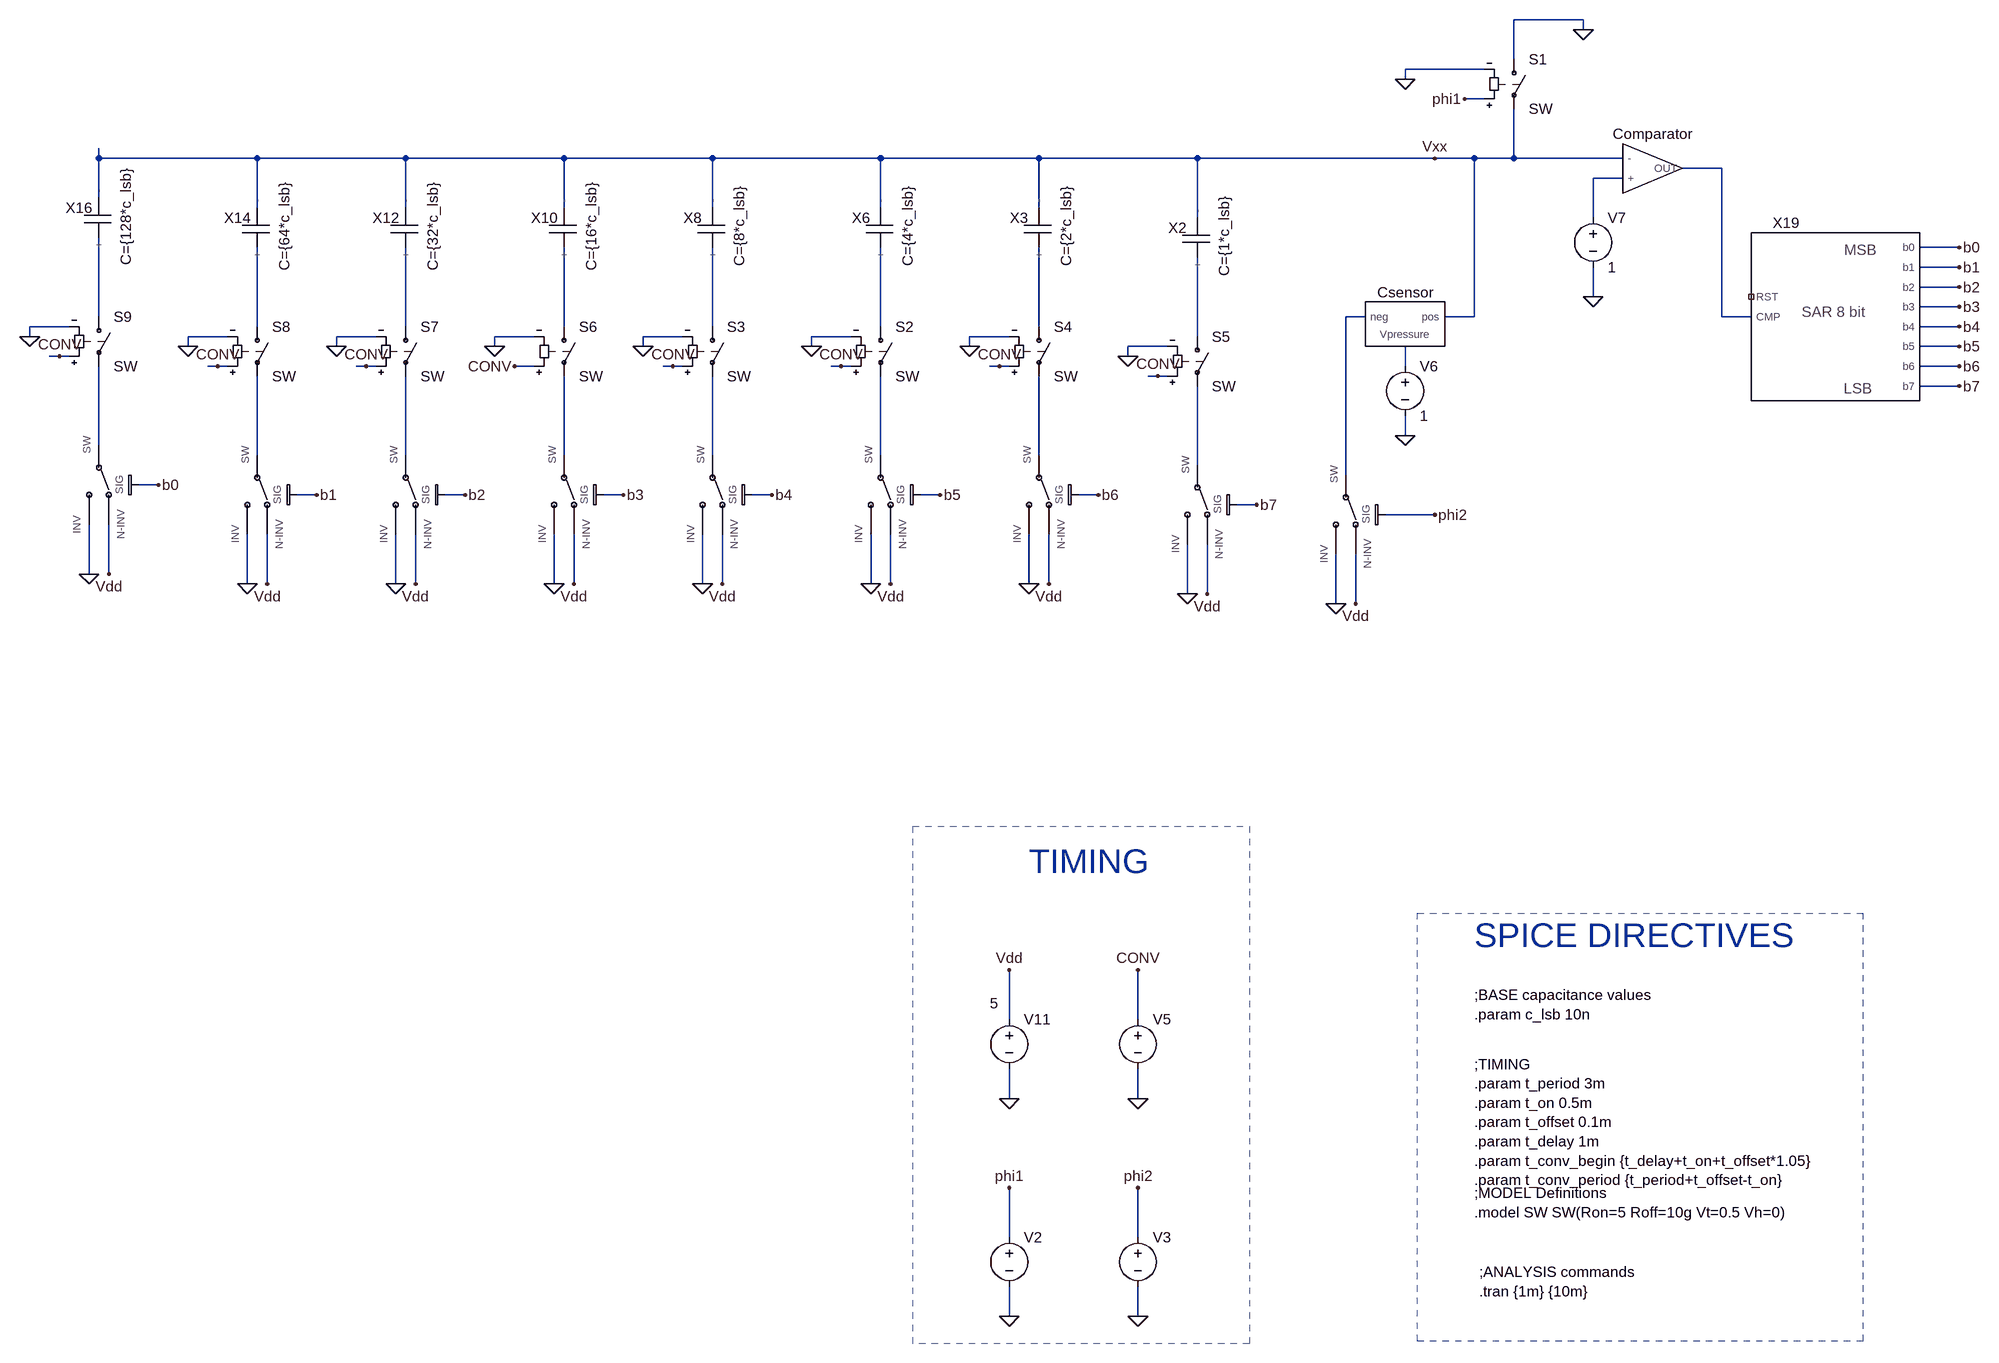
[diagram p0: schematic CIR_CDC.asc]
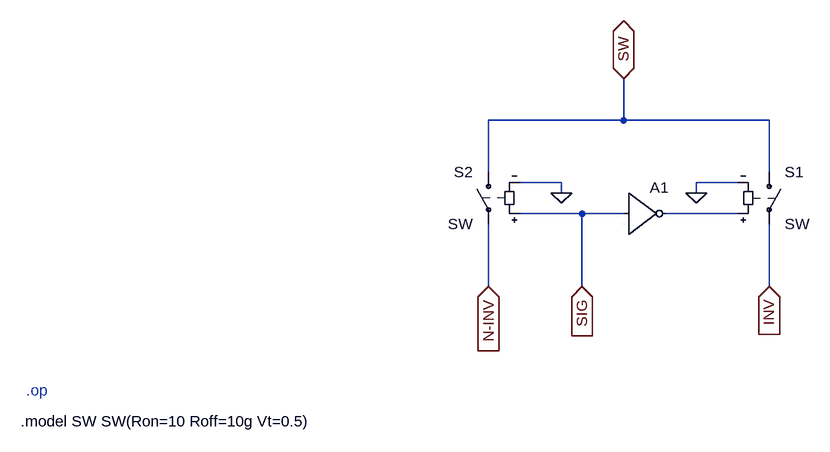
[diagram p1: sub-circuit com_spdt.asc]
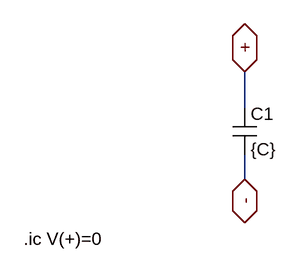
[diagram p2: sub-circuit com_cap.asc]
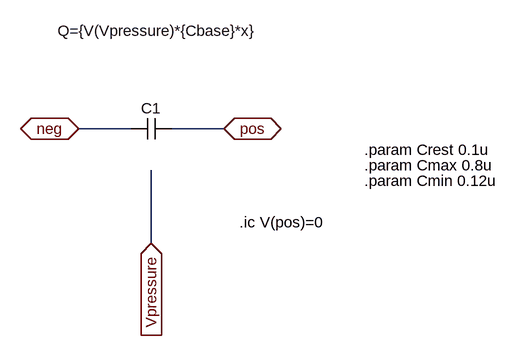
[diagram p3: sub-circuit sensor_cap.asc]
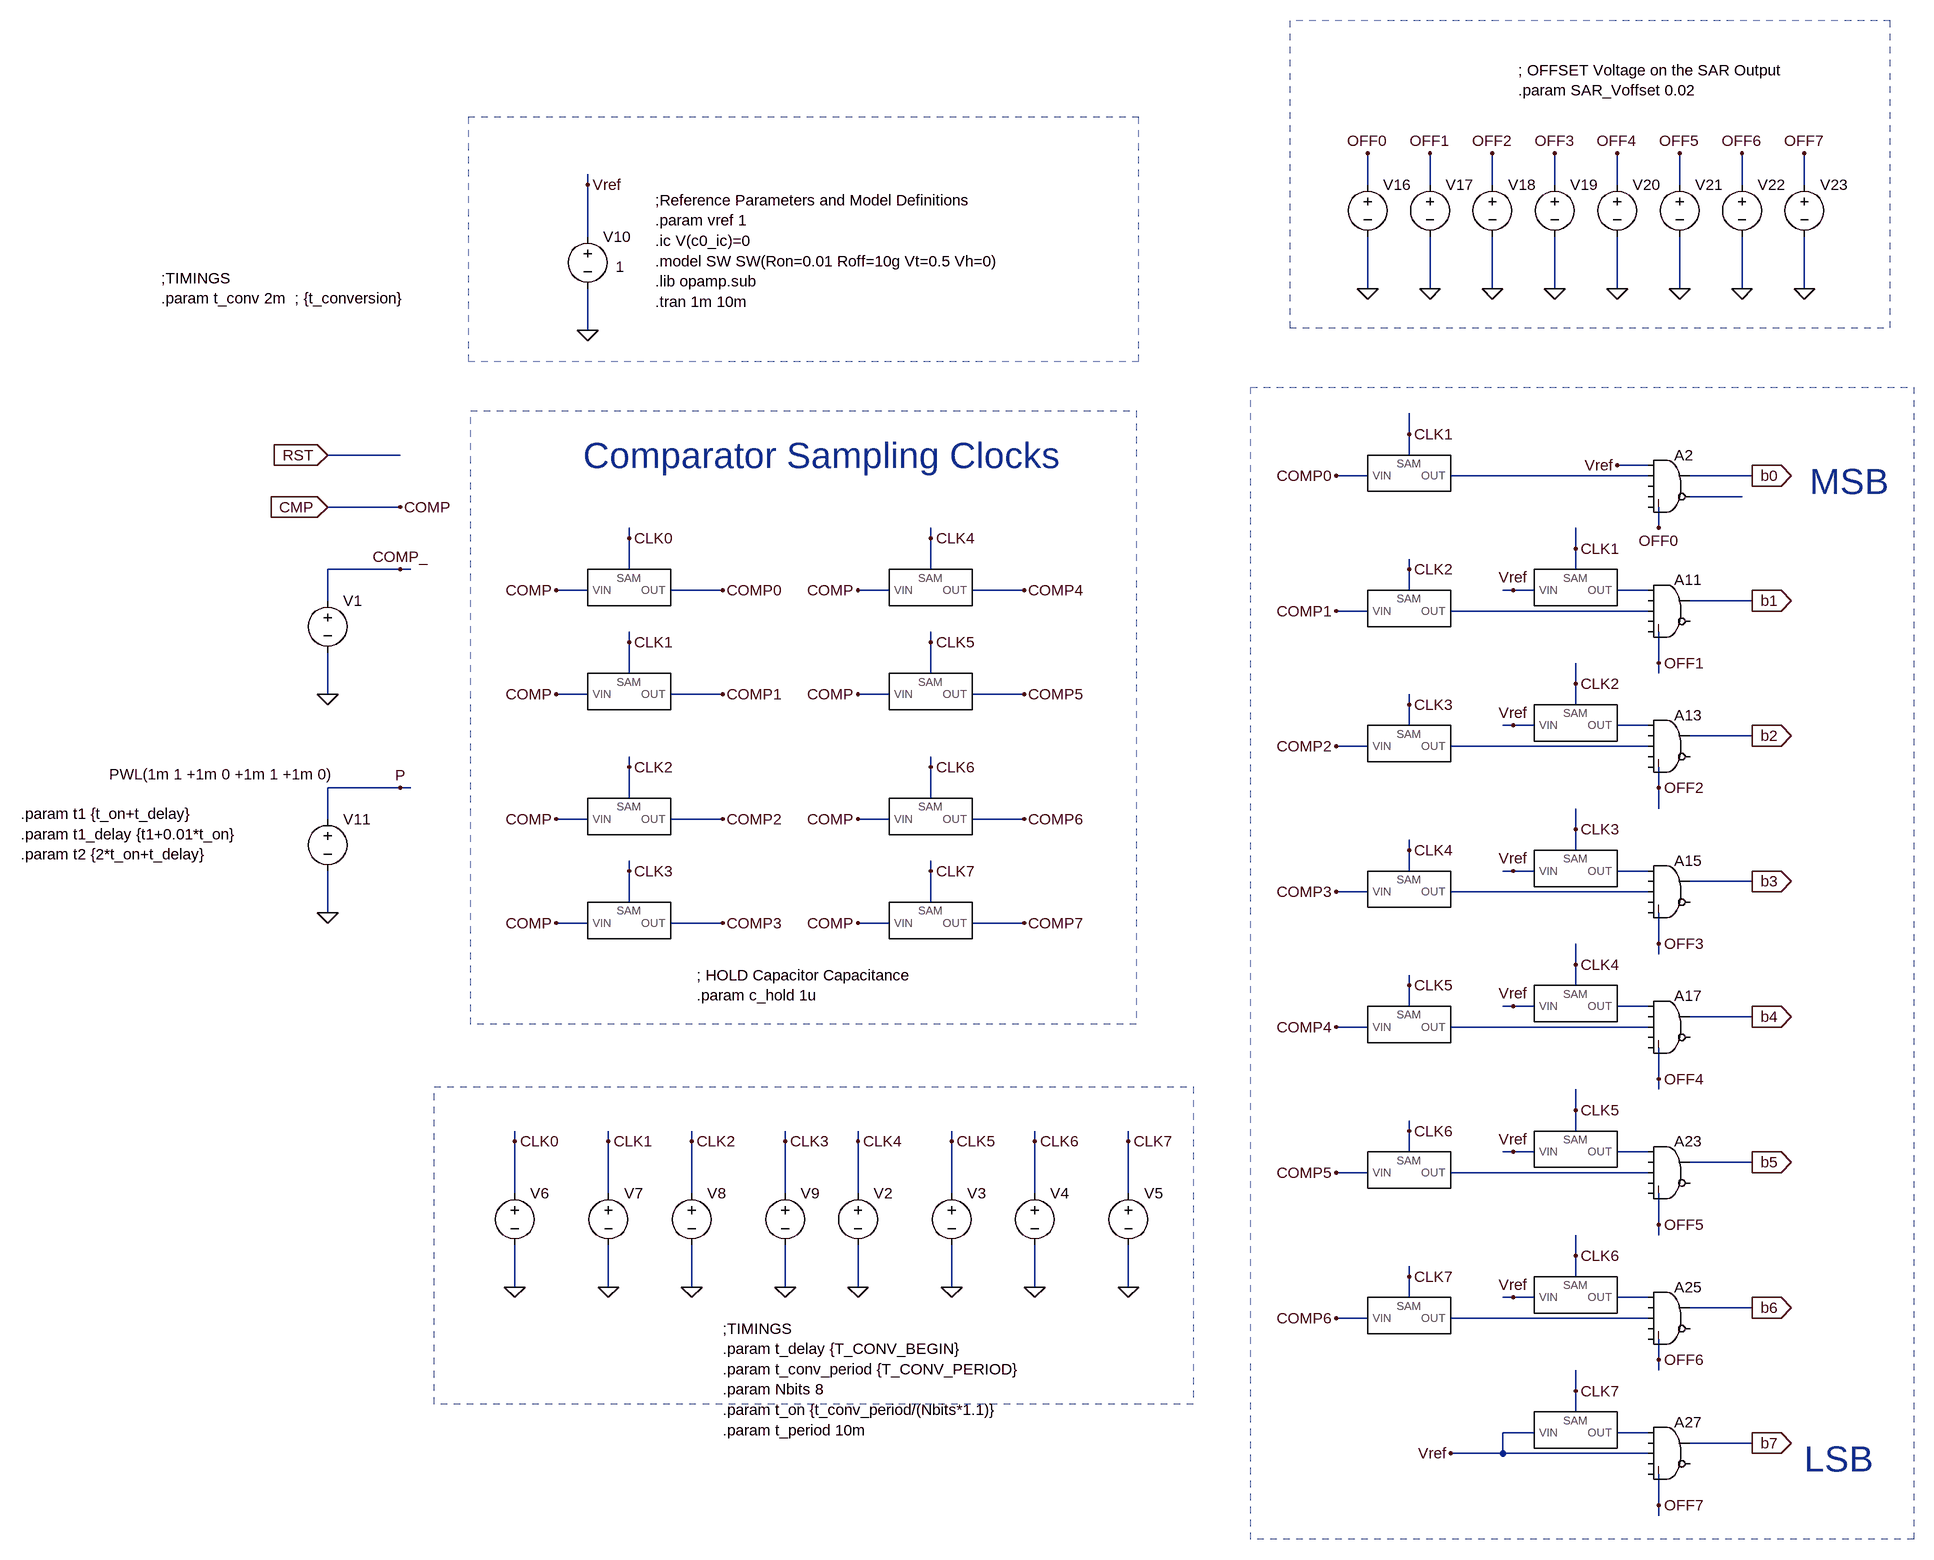
[diagram p4: sub-circuit com_sar.asc]
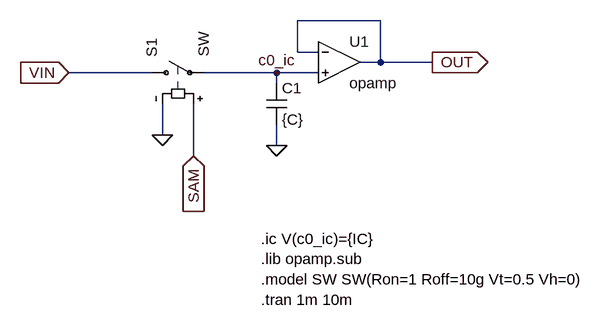
[diagram p5: sub-circuit com_sampleandhold.asc]
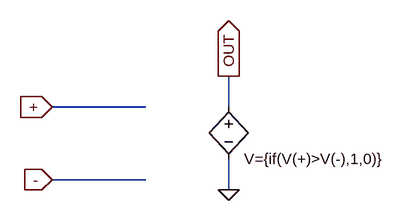
[diagram p6: sub-circuit com_comparator.asc]
CIR_CDC.asc, the LTspice schematic file:
Version 4
SHEET 1 3520 3184
WIRE 1216 144 1104 144
WIRE 1216 160 1216 144
WIRE 1104 208 1104 144
WIRE 1056 224 928 224
WIRE 928 240 928 224
WIRE 1056 272 1024 272
WIRE -1184 368 -1184 352
WIRE -928 368 -1184 368
WIRE -688 368 -928 368
WIRE -432 368 -688 368
WIRE -192 368 -432 368
WIRE 80 368 -192 368
WIRE 336 368 80 368
WIRE 592 368 336 368
WIRE 976 368 592 368
WIRE 1040 368 976 368
WIRE 1104 368 1104 288
WIRE 1104 368 1040 368
WIRE 1280 368 1104 368
WIRE 1440 384 1376 384
WIRE 1280 400 1232 400
WIRE -1184 432 -1184 368
WIRE -928 448 -928 368
WIRE -688 448 -688 368
WIRE -432 448 -432 368
WIRE -192 448 -192 368
WIRE 80 448 80 368
WIRE 336 448 336 368
WIRE 592 464 592 368
WIRE 1232 464 1232 400
WIRE 1824 512 1760 512
WIRE 1824 544 1760 544
WIRE 1824 576 1760 576
WIRE 1232 592 1232 544
WIRE 1824 608 1760 608
WIRE -1184 624 -1184 496
WIRE 864 624 832 624
WIRE 1040 624 1040 368
WIRE 1040 624 992 624
WIRE 1440 624 1440 384
WIRE 1488 624 1440 624
WIRE -1232 640 -1296 640
WIRE -928 640 -928 512
WIRE -688 640 -688 512
WIRE -432 640 -432 512
WIRE -192 640 -192 512
WIRE 80 640 80 512
WIRE 336 640 336 512
WIRE 1824 640 1760 640
WIRE -1296 656 -1296 640
WIRE -976 656 -1040 656
WIRE -736 656 -800 656
WIRE -480 656 -544 656
WIRE -240 656 -304 656
WIRE 32 656 -32 656
WIRE 288 656 224 656
WIRE 592 656 592 528
WIRE -1040 672 -1040 656
WIRE -800 672 -800 656
WIRE -544 672 -544 656
WIRE -304 672 -304 656
WIRE -32 672 -32 656
WIRE 224 672 224 656
WIRE 544 672 480 672
WIRE 1824 672 1760 672
WIRE -1248 688 -1264 688
WIRE -1232 688 -1248 688
WIRE 480 688 480 672
WIRE -992 704 -1008 704
WIRE -976 704 -992 704
WIRE -752 704 -768 704
WIRE -736 704 -752 704
WIRE -480 704 -512 704
WIRE -256 704 -272 704
WIRE -240 704 -256 704
WIRE 16 704 0 704
WIRE 32 704 16 704
WIRE 272 704 256 704
WIRE 288 704 272 704
WIRE 928 704 928 672
WIRE 1824 704 1760 704
WIRE 528 720 512 720
WIRE 544 720 528 720
WIRE 1824 736 1760 736
WIRE 928 816 928 784
WIRE -1184 832 -1184 704
WIRE -928 848 -928 720
WIRE -688 848 -688 720
WIRE -432 848 -432 720
WIRE -192 848 -192 720
WIRE 80 848 80 720
WIRE 336 848 336 720
WIRE 592 864 592 736
WIRE 832 880 832 624
WIRE -1088 896 -1120 896
WIRE -832 912 -864 912
WIRE -592 912 -624 912
WIRE -336 912 -368 912
WIRE -96 912 -128 912
WIRE 176 912 144 912
WIRE 432 912 400 912
WIRE 688 928 656 928
WIRE 976 944 896 944
WIRE -1200 1040 -1200 960
WIRE -1168 1040 -1168 960
WIRE -944 1056 -944 976
WIRE -912 1056 -912 976
WIRE -704 1056 -704 976
WIRE -672 1056 -672 976
WIRE -448 1056 -448 976
WIRE -416 1056 -416 976
WIRE -208 1056 -208 976
WIRE -176 1056 -176 976
WIRE 64 1056 64 976
WIRE 96 1056 96 976
WIRE 320 1056 320 976
WIRE 352 1056 352 976
WIRE 576 1072 576 992
WIRE 608 1072 608 992
WIRE 816 1088 816 1008
WIRE 848 1088 848 1008
WIRE 288 1760 288 1680
WIRE 496 1760 496 1680
WIRE 288 1888 288 1840
WIRE 496 1888 496 1840
WIRE 288 2112 288 2032
WIRE 496 2112 496 2032
WIRE 288 2240 288 2192
WIRE 496 2240 496 2192
FLAG 288 1888 0
FLAG 288 1680 Vdd
FLAG 1216 160 0
FLAG 288 2240 0
FLAG 288 2032 phi1
FLAG 496 2240 0
FLAG 496 2032 phi2
FLAG 1024 272 phi1
FLAG 928 240 0
FLAG 976 368 Vxx
FLAG 496 1888 0
FLAG 496 1680 CONV
FLAG 272 704 CONV
FLAG 224 672 0
FLAG 528 720 CONV
FLAG 480 688 0
FLAG 816 1088 0
FLAG 848 1088 Vdd
FLAG 976 944 phi2
FLAG 320 1056 0
FLAG 352 1056 Vdd
FLAG 576 1072 0
FLAG 608 1072 Vdd
FLAG 16 704 CONV
FLAG -32 672 0
FLAG 64 1056 0
FLAG 96 1056 Vdd
FLAG 176 912 b5
FLAG -256 704 CONV
FLAG -304 672 0
FLAG -208 1056 0
FLAG -176 1056 Vdd
FLAG -96 912 b4
FLAG -544 672 0
FLAG -448 1056 0
FLAG -416 1056 Vdd
FLAG -336 912 b3
FLAG -800 672 0
FLAG -704 1056 0
FLAG -672 1056 Vdd
FLAG -992 704 CONV
FLAG -1040 672 0
FLAG -944 1056 0
FLAG -912 1056 Vdd
FLAG -752 704 CONV
FLAG -512 704 CONV
FLAG -832 912 b1
FLAG -1248 688 CONV
FLAG -1296 656 0
FLAG -1200 1040 0
FLAG -1168 1040 Vdd
FLAG -1088 896 b0
FLAG -592 912 b2
FLAG 928 816 0
FLAG 1232 592 0
FLAG 1824 512 b0
FLAG 1824 544 b1
FLAG 1824 576 b2
FLAG 1824 608 b3
FLAG 1824 640 b4
FLAG 1824 672 b5
FLAG 1824 704 b6
FLAG 1824 736 b7
FLAG 432 912 b6
FLAG 688 928 b7
SYMBOL voltage 288 1744 R0
WINDOW 3 -31 -10 Left 2
WINDOW 0 24 16 Left 2
SYMATTR Value 5
SYMATTR InstName V11
SYMBOL voltage 496 2096 R0
WINDOW 3 -196 -32 Invisible 2
WINDOW 0 24 16 Left 2
SYMATTR Value PULSE(0 3 {t_delay} 1n 1n {t_on+t_offset} {t_period} 1)
SYMATTR InstName V3
SYMBOL voltage 288 2096 R0
WINDOW 3 -196 -32 Invisible 2
WINDOW 0 24 16 Left 2
SYMATTR Value PULSE(0 3 {t_delay} 1n 1n {t_on} {t_period} 1)
SYMATTR InstName V2
SYMBOL sw 1104 192 R0
SYMATTR InstName S1
SYMBOL voltage 496 1744 R0
WINDOW 3 -196 -32 Invisible 2
WINDOW 0 24 16 Left 2
SYMATTR Value PULSE(0 3 {t_conv_begin} 1n 1n {t_conv_period} {t_period} 1)
SYMATTR InstName V5
SYMBOL sw 336 624 R0
SYMATTR InstName S4
SYMBOL sw 592 640 R0
SYMATTR InstName S5
SYMBOL COM_SPDT 832 976 R270
WINDOW 0 48 -64 Invisible 2
SYMATTR InstName X1
SYMBOL COM_CAP 592 496 R180
WINDOW 0 32 16 Center 2
WINDOW 3 -28 0 VBottom 2
SYMATTR InstName X2
SYMATTR Value C={1*c_lsb}
SYMBOL COM_CAP 336 480 R180
WINDOW 0 32 16 Center 2
WINDOW 3 -28 0 VBottom 2
SYMATTR InstName X3
SYMATTR Value C={2*c_lsb}
SYMBOL COM_SPDT 336 944 R270
WINDOW 0 48 -64 Invisible 2
SYMATTR InstName X4
SYMBOL COM_SPDT 592 960 R270
WINDOW 0 48 -64 Invisible 2
SYMATTR InstName X5
SYMBOL sw 80 624 R0
SYMATTR InstName S2
SYMBOL COM_CAP 80 480 R180
WINDOW 0 32 16 Center 2
WINDOW 3 -28 0 VBottom 2
SYMATTR InstName X6
SYMATTR Value C={4*c_lsb}
SYMBOL COM_SPDT 80 944 R270
WINDOW 0 48 -64 Invisible 2
SYMATTR InstName X7
SYMBOL sw -192 624 R0
SYMATTR InstName S3
SYMBOL COM_CAP -192 480 R180
WINDOW 0 32 16 Center 2
WINDOW 3 -28 0 VBottom 2
SYMATTR InstName X8
SYMATTR Value C={8*c_lsb}
SYMBOL COM_SPDT -192 944 R270
WINDOW 0 48 -64 Invisible 2
SYMATTR InstName X9
SYMBOL sw -432 624 R0
SYMATTR InstName S6
SYMBOL COM_CAP -432 480 R180
WINDOW 0 32 16 Center 2
WINDOW 3 -28 0 VBottom 2
SYMATTR InstName X10
SYMATTR Value C={16*c_lsb}
SYMBOL COM_SPDT -432 944 R270
WINDOW 0 48 -64 Invisible 2
SYMATTR InstName X11
SYMBOL sw -688 624 R0
SYMATTR InstName S7
SYMBOL COM_CAP -688 480 R180
WINDOW 0 32 16 Center 2
WINDOW 3 -28 0 VBottom 2
SYMATTR InstName X12
SYMATTR Value C={32*c_lsb}
SYMBOL COM_SPDT -688 944 R270
WINDOW 0 48 -64 Invisible 2
SYMATTR InstName X13
SYMBOL sw -928 624 R0
SYMATTR InstName S8
SYMBOL COM_CAP -928 480 R180
WINDOW 0 32 16 Center 2
WINDOW 3 -28 0 VBottom 2
SYMATTR InstName X14
SYMATTR Value C={64*c_lsb}
SYMBOL COM_SPDT -928 944 R270
WINDOW 0 48 -64 Invisible 2
SYMATTR InstName X15
SYMBOL sw -1184 608 R0
SYMATTR InstName S9
SYMBOL COM_CAP -1184 464 R180
WINDOW 0 32 16 Center 2
WINDOW 3 -28 0 VBottom 2
SYMATTR InstName X16
SYMATTR Value C={128*c_lsb}
SYMBOL COM_SPDT -1184 928 R270
WINDOW 0 48 -64 Invisible 2
SYMATTR InstName X17
SYMBOL SENSOR_CAP 976 624 R0
WINDOW 39 0 0 Invisible 2
SYMATTR InstName Csensor
SYMATTR SpiceLine Cbase=10n
SYMBOL voltage 928 688 R0
SYMATTR InstName V6
SYMATTR Value 1
SYMBOL COM_SAR 1536 624 R0
WINDOW 0 8 -136 Bottom 2
WINDOW 39 0 0 Invisible 2
SYMATTR InstName X19
SYMATTR SpiceLine T_CONV_BEGIN={t_conv_begin}, T_CONV_PERIOD={t_conv_period}
SYMBOL COM_Comparator 1328 384 R0
SYMATTR InstName Comparator
SYMBOL voltage 1232 448 R0
SYMATTR InstName V7
SYMATTR Value 1
TEXT 1048 2168 Left 2 !;ANALYSIS commands\n.tran {1m} {10m}
TEXT 1040 2040 Left 2 !;MODEL Definitions\n.model SW SW(Ron=5 Roff=10g Vt=0.5 Vh=0)
TEXT 1040 1832 Left 2 !;TIMING\n.param t_period 3m\n.param t_on 0.5m\n.param t_offset 0.1m\n.param t_delay 1m\n.param t_conv_begin {t_delay+t_on+t_offset*1.05}\n.param t_conv_period {t_period+t_offset-t_on}
TEXT 1040 1720 Left 2 !;BASE capacitance values\n.param c_lsb 10n
TEXT 320 1504 Left 5 ;TIMING
TEXT 1040 1624 Left 5 ;SPICE DIRECTIVES
RECTANGLE Normal 948 1588 1668 2280 2
RECTANGLE Normal 676 2284 132 1448 2

com_spdt.asc, the sub-circuit schematic file:
Version 4
SHEET 1 880 736
WIRE 48 256 48 192
WIRE 48 256 -160 256
WIRE 272 256 48 256
WIRE -160 336 -160 256
WIRE 272 336 272 256
WIRE -48 352 -112 352
WIRE 224 352 160 352
WIRE -48 368 -48 352
WIRE 160 368 160 352
WIRE -16 400 -112 400
WIRE 48 400 -16 400
WIRE 224 400 112 400
WIRE -160 512 -160 416
WIRE -16 512 -16 400
WIRE 272 512 272 416
FLAG 160 368 0
FLAG -48 368 0
FLAG 48 192 SW
IOPIN 48 192 BiDir
FLAG 272 512 INV
IOPIN 272 512 In
FLAG -160 512 N-INV
IOPIN -160 512 In
FLAG -16 512 SIG
IOPIN -16 512 In
SYMBOL sw 272 320 R0
SYMATTR InstName S1
SYMBOL Digital/inv 48 336 R0
SYMATTR InstName A1
SYMBOL sw -160 320 M0
SYMATTR InstName S2
TEXT -880 720 Left 2 !.model SW SW(Ron=10 Roff=10g Vt=0.5)
TEXT -872 672 Left 2 ;.op

com_cap.asc, the sub-circuit schematic file:
Version 4
SHEET 1 880 680
WIRE 448 336 448 288
WIRE 448 432 448 400
FLAG 448 288 +
IOPIN 448 288 BiDir
FLAG 448 432 -
IOPIN 448 432 BiDir
SYMBOL cap 432 336 R0
SYMATTR InstName C1
SYMATTR Value {C}
TEXT 152 512 Left 2 !.ic V(+)=0

sensor_cap.asc, the sub-circuit schematic file:
Version 4
SHEET 1 968 680
WIRE 400 336 320 336
WIRE 544 336 464 336
WIRE 432 512 432 400
FLAG 432 512 Vpressure
IOPIN 432 512 In
FLAG 320 336 neg
IOPIN 320 336 BiDir
FLAG 544 336 pos
IOPIN 544 336 BiDir
SYMBOL cap 464 320 R90
WINDOW 0 0 32 VBottom 2
WINDOW 3 -150 22 VTop 2
SYMATTR InstName C1
SYMATTR Value Q={V(Vpressure)*{Cbase}*x}
TEXT 568 480 Left 2 !.ic V(pos)=0
TEXT 760 368 Left 2 !.param Crest 0.1u
TEXT 760 392 Left 2 !.param Cmax 0.8u
TEXT 760 416 Left 2 !.param Cmin 0.12u

com_sar.asc, the sub-circuit schematic file:
Version 4
SHEET 1 4896 2624
WIRE -432 -544 -432 -560
WIRE 768 -544 768 -592
WIRE 864 -544 864 -592
WIRE 960 -544 960 -592
WIRE 1056 -544 1056 -592
WIRE 1152 -544 1152 -592
WIRE 1248 -544 1248 -592
WIRE 1344 -544 1344 -592
WIRE 1440 -544 1440 -592
WIRE -432 -464 -432 -544
WIRE 768 -384 768 -464
WIRE 864 -384 864 -464
WIRE 960 -384 960 -464
WIRE 1056 -384 1056 -464
WIRE 1152 -384 1152 -464
WIRE 1248 -384 1248 -464
WIRE 1344 -384 1344 -464
WIRE 1440 -384 1440 -464
WIRE -432 -320 -432 -384
WIRE 832 -160 832 -192
WIRE -720 -128 -832 -128
WIRE 832 -128 832 -160
WIRE 1200 -112 1152 -112
WIRE 768 -96 720 -96
WIRE 1200 -96 896 -96
WIRE 1360 -96 1264 -96
WIRE 1344 -64 1264 -64
WIRE -720 -48 -832 -48
WIRE 1216 -16 1216 -48
WIRE -368 0 -368 -16
WIRE 96 0 96 -16
WIRE 1088 16 1088 -16
WIRE -720 48 -832 48
WIRE -704 48 -720 48
WIRE -368 48 -368 0
WIRE 96 48 96 0
WIRE 832 48 832 32
WIRE 1088 48 1088 16
WIRE -432 80 -480 80
WIRE -224 80 -304 80
WIRE 32 80 -16 80
WIRE 240 80 160 80
WIRE 832 80 832 48
WIRE 992 80 976 80
WIRE 1024 80 992 80
WIRE 1200 80 1152 80
WIRE -832 96 -832 48
WIRE 1360 96 1264 96
WIRE 768 112 720 112
WIRE 1200 112 896 112
WIRE -368 160 -368 144
WIRE 96 160 96 144
WIRE 1216 192 1216 144
WIRE -368 208 -368 160
WIRE 96 208 96 160
WIRE 1216 208 1216 192
WIRE 1088 224 1088 192
WIRE -832 240 -832 176
WIRE -432 240 -480 240
WIRE -224 240 -304 240
WIRE 32 240 -16 240
WIRE 240 240 160 240
WIRE 832 256 832 240
WIRE 1088 256 1088 224
WIRE 832 288 832 256
WIRE 992 288 976 288
WIRE 1024 288 992 288
WIRE 1200 288 1152 288
WIRE 1360 304 1264 304
WIRE 768 320 720 320
WIRE 1200 320 896 320
WIRE -368 352 -368 336
WIRE 96 352 96 336
WIRE -720 384 -832 384
WIRE -704 384 -720 384
WIRE 1216 384 1216 352
WIRE -368 400 -368 352
WIRE 96 400 96 352
WIRE 1216 416 1216 384
WIRE -832 432 -832 384
WIRE -432 432 -480 432
WIRE -224 432 -304 432
WIRE 32 432 -16 432
WIRE 240 432 160 432
WIRE 1088 448 1088 416
WIRE 832 480 832 464
WIRE 1088 480 1088 448
WIRE -368 512 -368 496
WIRE 96 512 96 496
WIRE 832 512 832 480
WIRE 992 512 976 512
WIRE 1024 512 992 512
WIRE 1200 512 1152 512
WIRE 1360 528 1264 528
WIRE 768 544 720 544
WIRE 1200 544 896 544
WIRE -368 560 -368 512
WIRE 96 560 96 512
WIRE -832 576 -832 512
WIRE -432 592 -480 592
WIRE -224 592 -304 592
WIRE 32 592 -16 592
WIRE 240 592 160 592
WIRE 1216 624 1216 576
WIRE 1216 640 1216 624
WIRE 1088 656 1088 624
WIRE 832 688 832 672
WIRE 1088 688 1088 656
WIRE 832 720 832 688
WIRE 992 720 976 720
WIRE 1024 720 992 720
WIRE 1200 720 1152 720
WIRE 1360 736 1264 736
WIRE 768 752 720 752
WIRE 1200 752 896 752
WIRE 1216 832 1216 784
WIRE 1216 848 1216 832
WIRE 1088 880 1088 848
WIRE 832 912 832 896
WIRE 1088 912 1088 880
WIRE -544 928 -544 912
WIRE -400 928 -400 912
WIRE -272 928 -272 912
WIRE -128 928 -128 912
WIRE -16 928 -16 912
WIRE 128 928 128 912
WIRE 256 928 256 912
WIRE 400 928 400 912
WIRE 832 944 832 912
WIRE 992 944 976 944
WIRE 1024 944 992 944
WIRE 1200 944 1152 944
WIRE 1360 960 1264 960
WIRE 768 976 720 976
WIRE 1200 976 896 976
WIRE -544 1008 -544 928
WIRE -400 1008 -400 928
WIRE -272 1008 -272 928
WIRE -128 1008 -128 928
WIRE -16 1008 -16 928
WIRE 128 1008 128 928
WIRE 256 1008 256 928
WIRE 400 1008 400 928
WIRE 1216 1056 1216 1008
WIRE 1216 1072 1216 1056
WIRE 1088 1104 1088 1072
WIRE 832 1136 832 1120
WIRE 1088 1136 1088 1104
WIRE -544 1152 -544 1088
WIRE -400 1152 -400 1088
WIRE -272 1152 -272 1088
WIRE -128 1152 -128 1088
WIRE -16 1152 -16 1088
WIRE 128 1152 128 1088
WIRE 256 1152 256 1088
WIRE 400 1152 400 1088
WIRE 832 1168 832 1136
WIRE 992 1168 976 1168
WIRE 1024 1168 992 1168
WIRE 1200 1168 1152 1168
WIRE 1360 1184 1264 1184
WIRE 768 1200 720 1200
WIRE 1200 1200 896 1200
WIRE 1216 1264 1216 1232
WIRE 1216 1280 1216 1264
WIRE 1088 1312 1088 1280
WIRE 1088 1344 1088 1312
WIRE 1024 1376 976 1376
WIRE 1200 1376 1152 1376
WIRE 1360 1392 1264 1392
WIRE 976 1408 976 1376
WIRE 976 1408 896 1408
WIRE 1200 1408 976 1408
WIRE 1216 1488 1216 1440
WIRE 1216 1504 1216 1488
FLAG -16 1152 0
FLAG -16 928 CLK4
FLAG 128 1152 0
FLAG 128 928 CLK5
FLAG 256 1152 0
FLAG 256 928 CLK6
FLAG 400 1152 0
FLAG 400 928 CLK7
FLAG -544 1152 0
FLAG -544 928 CLK0
FLAG -400 1152 0
FLAG -400 928 CLK1
FLAG -272 1152 0
FLAG -272 928 CLK2
FLAG -128 1152 0
FLAG -128 928 CLK3
FLAG -432 -320 0
FLAG -432 -544 Vref
FLAG -16 432 COMP
FLAG 96 352 CLK6
FLAG 240 432 COMP6
FLAG -16 592 COMP
FLAG 96 512 CLK7
FLAG 240 592 COMP7
FLAG -480 432 COMP
FLAG -368 352 CLK2
FLAG -224 432 COMP2
FLAG -480 592 COMP
FLAG -368 512 CLK3
FLAG -224 592 COMP3
FLAG -16 80 COMP
FLAG 96 0 CLK4
FLAG 240 80 COMP4
FLAG -16 240 COMP
FLAG 96 160 CLK5
FLAG 240 240 COMP5
FLAG -480 80 COMP
FLAG -368 0 CLK0
FLAG -224 80 COMP0
FLAG -480 240 COMP
FLAG -368 160 CLK1
FLAG -224 240 COMP1
FLAG 1360 -96 b0
IOPIN 1360 -96 Out
FLAG 1152 -112 Vref
FLAG 720 -96 COMP0
FLAG 832 -160 CLK1
FLAG 1360 96 b1
IOPIN 1360 96 Out
FLAG 720 112 COMP1
FLAG 832 48 CLK2
FLAG 1088 16 CLK1
FLAG 1360 304 b2
IOPIN 1360 304 Out
FLAG 720 320 COMP2
FLAG 832 256 CLK3
FLAG 1088 224 CLK2
FLAG 1360 528 b3
IOPIN 1360 528 Out
FLAG 720 544 COMP3
FLAG 832 480 CLK4
FLAG 1088 448 CLK3
FLAG 1360 736 b4
IOPIN 1360 736 Out
FLAG 720 752 COMP4
FLAG 832 688 CLK5
FLAG 1088 656 CLK4
FLAG 1360 960 b5
IOPIN 1360 960 Out
FLAG 720 976 COMP5
FLAG 832 912 CLK6
FLAG 1088 880 CLK5
FLAG 1360 1184 b6
IOPIN 1360 1184 Out
FLAG 720 1200 COMP6
FLAG 832 1136 CLK7
FLAG 1088 1104 CLK6
FLAG 1360 1392 b7
IOPIN 1360 1392 Out
FLAG 1088 1312 CLK7
FLAG 992 80 Vref
FLAG 992 288 Vref
FLAG 992 512 Vref
FLAG 992 720 Vref
FLAG 992 944 Vref
FLAG 992 1168 Vref
FLAG 896 1408 Vref
FLAG 768 -384 0
FLAG 768 -592 OFF0
FLAG 864 -384 0
FLAG 864 -592 OFF1
FLAG 960 -384 0
FLAG 960 -592 OFF2
FLAG 1056 -384 0
FLAG 1056 -592 OFF3
FLAG 1152 -384 0
FLAG 1152 -592 OFF4
FLAG 1248 -384 0
FLAG 1248 -592 OFF5
FLAG 1344 -384 0
FLAG 1344 -592 OFF6
FLAG 1440 -384 0
FLAG 1440 -592 OFF7
FLAG 1216 -16 OFF0
FLAG 1216 192 OFF1
FLAG 1216 384 OFF2
FLAG 1216 624 OFF3
FLAG 1216 832 OFF4
FLAG 1216 1056 OFF5
FLAG 1216 1264 OFF6
FLAG 1216 1488 OFF7
FLAG -832 240 0
FLAG -720 48 COMP_
FLAG -832 576 0
FLAG -720 384 P
FLAG -832 -48 CMP
IOPIN -832 -48 In
FLAG -720 -48 COMP
FLAG -832 -128 RST
IOPIN -832 -128 In
SYMBOL voltage -16 992 R0
WINDOW 3 24 96 Invisible 2
SYMATTR Value PULSE(0 1 {t_delay+4*t_on} 1n 1n {t_on} {t_period} 1)
SYMATTR InstName V2
SYMBOL voltage 128 992 R0
WINDOW 3 24 96 Invisible 2
SYMATTR Value PULSE(0 1 {t_delay+5*t_on} 1n 1n {t_on} {t_period} 1)
SYMATTR InstName V3
SYMBOL voltage 256 992 R0
WINDOW 3 24 96 Invisible 2
SYMATTR Value PULSE(0 1 {t_delay+6*t_on} 1n 1n {t_on} {t_period} 1)
SYMATTR InstName V4
SYMBOL voltage 400 992 R0
WINDOW 3 24 96 Invisible 2
SYMATTR Value PULSE(0 1 {t_delay+7*t_on} 1n 1n {t_on} {t_period} 1)
SYMATTR InstName V5
SYMBOL voltage -544 992 R0
WINDOW 3 24 96 Invisible 2
SYMATTR Value PULSE(0 1 {t_delay} 1n 1n {t_on} {t_period} 1)
SYMATTR InstName V6
SYMBOL voltage -400 992 R0
WINDOW 3 24 96 Invisible 2
SYMATTR Value PULSE(0 1 {t_delay+t_on} 1n 1n {t_on} {t_period} 1)
SYMATTR InstName V7
SYMBOL voltage -272 992 R0
WINDOW 3 24 96 Invisible 2
SYMATTR Value PULSE(0 1 {t_delay+2*t_on} 1n 1n {t_on} {t_period} 1)
SYMATTR InstName V8
SYMBOL voltage -128 992 R0
WINDOW 3 24 96 Invisible 2
SYMATTR Value PULSE(0 1 {t_delay+3*t_on} 1n 1n {t_on} {t_period} 1)
SYMATTR InstName V9
SYMBOL voltage -432 -480 R0
WINDOW 3 50 62 Center 2
SYMATTR Value 1
SYMATTR InstName V10
SYMBOL COM_SampleAndHold 96 448 R0
WINDOW 0 0 -56 Invisible 2
WINDOW 39 0 0 Invisible 2
SYMATTR InstName X1
SYMBOL COM_SampleAndHold 96 608 R0
WINDOW 0 0 -56 Invisible 2
WINDOW 39 0 0 Invisible 2
SYMATTR InstName X2
SYMBOL COM_SampleAndHold -368 448 R0
WINDOW 0 0 -56 Invisible 2
WINDOW 39 0 0 Invisible 2
SYMATTR InstName X3
SYMBOL COM_SampleAndHold -368 608 R0
WINDOW 0 0 -56 Invisible 2
WINDOW 39 0 0 Invisible 2
SYMATTR InstName X4
SYMBOL COM_SampleAndHold 96 96 R0
WINDOW 0 0 -56 Invisible 2
WINDOW 39 0 0 Invisible 2
SYMATTR InstName X5
SYMBOL COM_SampleAndHold 96 256 R0
WINDOW 0 0 -56 Invisible 2
WINDOW 39 0 0 Invisible 2
SYMATTR InstName X6
SYMBOL COM_SampleAndHold -368 96 R0
WINDOW 0 0 -56 Invisible 2
WINDOW 39 0 0 Invisible 2
SYMATTR InstName X7
SYMBOL COM_SampleAndHold -368 256 R0
WINDOW 0 0 -56 Invisible 2
WINDOW 39 0 0 Invisible 2
SYMATTR InstName X8
SYMBOL Digital/and 1232 -144 R0
SYMATTR InstName A2
SYMBOL COM_SampleAndHold 832 -80 R0
WINDOW 0 0 -56 Invisible 2
WINDOW 39 0 0 Invisible 2
SYMATTR InstName X10
SYMATTR SpiceLine C=1u, IC=1
SYMBOL Digital/and 1232 48 R0
SYMATTR InstName A11
SYMBOL COM_SampleAndHold 1088 96 R0
WINDOW 0 0 -56 Invisible 2
WINDOW 39 0 0 Invisible 2
SYMATTR InstName X12
SYMBOL COM_SampleAndHold 832 128 R0
WINDOW 0 0 -56 Invisible 2
WINDOW 39 0 0 Invisible 2
SYMATTR InstName X13
SYMATTR SpiceLine C=1u, IC=1
SYMBOL Digital/and 1232 256 R0
SYMATTR InstName A13
SYMBOL COM_SampleAndHold 1088 304 R0
WINDOW 0 0 -56 Invisible 2
WINDOW 39 0 0 Invisible 2
SYMATTR InstName X17
SYMBOL COM_SampleAndHold 832 336 R0
WINDOW 0 0 -56 Invisible 2
WINDOW 39 0 0 Invisible 2
SYMATTR InstName X18
SYMATTR SpiceLine C=1u, IC=1
SYMBOL Digital/and 1232 480 R0
SYMATTR InstName A15
SYMBOL COM_SampleAndHold 1088 528 R0
WINDOW 0 0 -56 Invisible 2
WINDOW 39 0 0 Invisible 2
SYMATTR InstName X19
SYMBOL COM_SampleAndHold 832 560 R0
WINDOW 0 0 -56 Invisible 2
WINDOW 39 0 0 Invisible 2
SYMATTR InstName X20
SYMATTR SpiceLine C=1u, IC=1
SYMBOL Digital/and 1232 688 R0
SYMATTR InstName A17
SYMBOL COM_SampleAndHold 1088 736 R0
WINDOW 0 0 -56 Invisible 2
WINDOW 39 0 0 Invisible 2
SYMATTR InstName X21
SYMBOL COM_SampleAndHold 832 768 R0
WINDOW 0 0 -56 Invisible 2
WINDOW 39 0 0 Invisible 2
SYMATTR InstName X22
SYMATTR SpiceLine C=1u, IC=1
SYMBOL Digital/and 1232 912 R0
SYMATTR InstName A23
SYMBOL COM_SampleAndHold 1088 960 R0
WINDOW 0 0 -56 Invisible 2
WINDOW 39 0 0 Invisible 2
SYMATTR InstName X23
SYMBOL COM_SampleAndHold 832 992 R0
WINDOW 0 0 -56 Invisible 2
WINDOW 39 0 0 Invisible 2
SYMATTR InstName X24
SYMATTR SpiceLine C=1u, IC=1
SYMBOL Digital/and 1232 1136 R0
SYMATTR InstName A25
SYMBOL COM_SampleAndHold 1088 1184 R0
WINDOW 0 0 -56 Invisible 2
WINDOW 39 0 0 Invisible 2
SYMATTR InstName X25
SYMBOL COM_SampleAndHold 832 1216 R0
WINDOW 0 0 -56 Invisible 2
WINDOW 39 0 0 Invisible 2
SYMATTR InstName X26
SYMATTR SpiceLine C=1u, IC=1
SYMBOL Digital/and 1232 1344 R0
SYMATTR InstName A27
SYMBOL COM_SampleAndHold 1088 1392 R0
WINDOW 0 0 -56 Invisible 2
WINDOW 39 0 0 Invisible 2
SYMATTR InstName X27
SYMBOL voltage 768 -560 R0
WINDOW 3 24 96 Invisible 2
SYMATTR InstName V16
SYMATTR Value {0*SAR_Voffset}
SYMBOL voltage 864 -560 R0
WINDOW 3 24 96 Invisible 2
SYMATTR InstName V17
SYMATTR Value {1*SAR_Voffset}
SYMBOL voltage 960 -560 R0
WINDOW 3 24 96 Invisible 2
SYMATTR InstName V18
SYMATTR Value {2*SAR_Voffset}
SYMBOL voltage 1056 -560 R0
WINDOW 3 24 96 Invisible 2
SYMATTR InstName V19
SYMATTR Value {3*SAR_Voffset}
SYMBOL voltage 1152 -560 R0
WINDOW 3 24 96 Invisible 2
SYMATTR InstName V20
SYMATTR Value {4*SAR_Voffset}
SYMBOL voltage 1248 -560 R0
WINDOW 3 24 96 Invisible 2
SYMATTR InstName V21
SYMATTR Value {5*SAR_Voffset}
SYMBOL voltage 1344 -560 R0
WINDOW 3 24 96 Invisible 2
SYMATTR InstName V22
SYMATTR Value {6*SAR_Voffset}
SYMBOL voltage 1440 -560 R0
WINDOW 3 24 96 Invisible 2
SYMATTR InstName V23
SYMATTR Value {7*SAR_Voffset}
SYMBOL voltage -832 80 R0
WINDOW 3 24 96 Invisible 2
SYMATTR Value PULSE(0 1.01 {t_delay} 1n 1n {2*t_on} {4*t_on} 4)
SYMATTR InstName V1
SYMBOL voltage -832 416 R0
WINDOW 3 -162 -53 Center 2
SYMATTR Value PWL(1m 1 +1m 0 +1m 1 +1m 0)
SYMATTR InstName V11
TEXT -224 1216 Left 2 !;TIMINGS\n.param t_delay {T_CONV_BEGIN}\n.param t_conv_period {T_CONV_PERIOD}\n.param Nbits 8\n.param t_on {t_conv_period/(Nbits*1.1)}\n.param t_period 10m
TEXT -264 672 Left 2 !; HOLD Capacitor Capacitance\n.param c_hold 1u
TEXT 1000 -720 Left 2 !; OFFSET Voltage on the SAR Output\n.param SAR_Voffset 0.02
TEXT 1448 -88 Left 5 ;MSB
TEXT 1440 1416 Left 5 ;LSB
TEXT -328 -520 Left 2 !;Reference Parameters and Model Definitions\n.param vref 1\n.ic V(c0_ic)=0\n.model SW SW(Ron=0.01 Roff=10g Vt=0.5 Vh=0)\n.lib opamp.sub\n.tran 1m 10m
TEXT -72 -128 Center 5 ;Comparator Sampling Clocks
TEXT -1304 424 Left 2 !.param t1 {t_on+t_delay}\n.param t1_delay {t1+0.01*t_on}\n.param t2 {2*t_on+t_delay}
TEXT -1088 -400 Left 2 !;TIMINGS\n.param t_conv 2m  ; {t_conversion}
RECTANGLE Normal -668 844 500 1332 2
RECTANGLE Normal 588 -232 1608 1540 2
RECTANGLE Normal 648 -324 1572 -796 2
RECTANGLE Normal -616 -272 416 -648 2
RECTANGLE Normal -612 -196 412 748 2

com_sampleandhold.asc, the sub-circuit schematic file:
Version 4
SHEET 1 880 680
WIRE 496 192 368 192
WIRE 368 240 368 192
WIRE 400 240 368 240
WIRE 496 256 496 192
WIRE 496 256 464 256
WIRE 576 256 496 256
WIRE 144 272 16 272
WIRE 336 272 224 272
WIRE 400 272 336 272
WIRE 336 288 336 272
WIRE 160 368 160 320
WIRE 336 384 336 352
WIRE 208 400 208 320
FLAG 336 384 0
FLAG 160 368 0
FLAG 576 256 OUT
IOPIN 576 256 Out
FLAG 208 400 SAM
IOPIN 208 400 In
FLAG 16 272 VIN
IOPIN 16 272 In
FLAG 336 272 c0_ic
SYMBOL Opamps/opamp 432 192 R0
SYMATTR InstName U1
SYMATTR SpiceLine Aol=1000K
SYMATTR SpiceLine2 GBW=10000Meg
SYMBOL sw 128 272 R270
SYMATTR InstName S1
SYMBOL cap 320 288 R0
SYMATTR InstName C1
SYMATTR Value {C}
TEXT 312 528 Left 2 !.ic V(c0_ic)={IC}\n.lib opamp.sub\n.model SW SW(Ron=1 Roff=10g Vt=0.5 Vh=0)\n.tran 1m 10m

com_comparator.asc, the sub-circuit schematic file:
Version 4
SHEET 1 4896 2624
WIRE 2832 -384 2688 -384
WIRE 2960 -384 2960 -432
WIRE 2832 -272 2688 -272
WIRE 2960 -256 2960 -304
FLAG 2960 -256 0
FLAG 2688 -384 +
IOPIN 2688 -384 In
FLAG 2688 -272 -
IOPIN 2688 -272 In
FLAG 2960 -432 OUT
IOPIN 2960 -432 Out
SYMBOL bv 2960 -400 R0
WINDOW 0 24 16 Invisible 2
SYMATTR InstName 1
SYMATTR Value V={if(V(+)>V(-),1,0)}

The netlist it stands for:
* CIR_CDC.asc
V11 Vdd 0 5
V3 phi2 0 PULSE(0 3 {t_delay} 1n 1n {t_on+t_offset} {t_period} 1)
V2 phi1 0 PULSE(0 3 {t_delay} 1n 1n {t_on} {t_period} 1)
S1 0 Vxx phi1 0 SW
V5 CONV 0 PULSE(0 3 {t_conv_begin} 1n 1n {t_conv_period} {t_period} 1)
S4 N010 N019 CONV 0 SW
S5 N011 N020 CONV 0 SW
XX1 0 Vdd phi2 N004 com_spdt
XX2 N011 Vxx com_cap params: C={1*c_lsb}
XX3 N010 Vxx com_cap params: C={2*c_lsb}
XX4 0 Vdd b6 N019 com_spdt
XX5 0 Vdd b7 N020 com_spdt
S2 N009 N018 CONV 0 SW
XX6 N009 Vxx com_cap params: C={4*c_lsb}
XX7 0 Vdd b5 N018 com_spdt
S3 N008 N017 CONV 0 SW
XX8 N008 Vxx com_cap params: C={8*c_lsb}
XX9 0 Vdd b4 N017 com_spdt
S6 N007 N016 CONV 0 SW
XX10 N007 Vxx com_cap params: C={16*c_lsb}
XX11 0 Vdd b3 N016 com_spdt
S7 N006 N015 CONV 0 SW
XX12 N006 Vxx com_cap params: C={32*c_lsb}
XX13 0 Vdd b2 N015 com_spdt
S8 N005 N014 CONV 0 SW
XX14 N005 Vxx com_cap params: C={64*c_lsb}
XX15 0 Vdd b1 N014 com_spdt
S9 N003 N013 CONV 0 SW
XX16 N003 Vxx com_cap params: C={128*c_lsb}
XX17 0 Vdd b0 N013 com_spdt
XCsensor N012 N004 Vxx sensor_cap params: Cbase=10n
V6 N012 0 1
XX19 N001 b0 b1 b2 b3 b4 b5 b6 b7 NC_01 com_sar params: T_CONV_BEGIN={t_conv_begin}, T_CONV_PERIOD={t_conv_period}
XComparator N002 Vxx N001 com_comparator
V7 N002 0 1

* block symbol definitions
.subckt com_spdt INV N-INV SIG SW
S1 SW INV N001 0 SW
A1 SIG 0 0 0 0 N001 0 0 BUF
S2 SW N-INV SIG 0 SW
.model SW SW(Ron=10 Roff=10g Vt=0.5)
* .op
.ends com_spdt

.subckt com_cap + -
C1 + - {C}
.ic V(+)=0
.ends com_cap

.subckt sensor_cap Vpressure neg pos
C1 pos neg Q={V(Vpressure)*{Cbase}*x}
.ic V(pos)=0
.param Crest 0.1u
.param Cmax 0.8u
.param Cmin 0.12u
.ends sensor_cap

.subckt com_sar CMP b0 b1 b2 b3 b4 b5 b6 b7 RST
V2 CLK4 0 PULSE(0 1 {t_delay+4*t_on} 1n 1n {t_on} {t_period} 1)
V3 CLK5 0 PULSE(0 1 {t_delay+5*t_on} 1n 1n {t_on} {t_period} 1)
V4 CLK6 0 PULSE(0 1 {t_delay+6*t_on} 1n 1n {t_on} {t_period} 1)
V5 CLK7 0 PULSE(0 1 {t_delay+7*t_on} 1n 1n {t_on} {t_period} 1)
V6 CLK0 0 PULSE(0 1 {t_delay} 1n 1n {t_on} {t_period} 1)
V7 CLK1 0 PULSE(0 1 {t_delay+t_on} 1n 1n {t_on} {t_period} 1)
V8 CLK2 0 PULSE(0 1 {t_delay+2*t_on} 1n 1n {t_on} {t_period} 1)
V9 CLK3 0 PULSE(0 1 {t_delay+3*t_on} 1n 1n {t_on} {t_period} 1)
V10 Vref 0 1
XX1 CLK6 CMP COMP6 com_sampleandhold params: C=1u, IC=0
XX2 CLK7 CMP COMP7 com_sampleandhold params: C=1u, IC=0
XX3 CLK2 CMP COMP2 com_sampleandhold params: C=1u, IC=0
XX4 CLK3 CMP COMP3 com_sampleandhold params: C=1u, IC=0
XX5 CLK4 CMP COMP4 com_sampleandhold params: C=1u, IC=0
XX6 CLK5 CMP COMP5 com_sampleandhold params: C=1u, IC=0
XX7 CLK0 CMP COMP0 com_sampleandhold params: C=1u, IC=0
XX8 CLK1 CMP COMP1 com_sampleandhold params: C=1u, IC=0
A2 Vref N001 OFF0 OFF0 OFF0 N002 b0 OFF0 AND
XX10 CLK1 COMP0 N001 com_sampleandhold params: C=1u, IC=1
A11 N003 OFF1 N004 OFF1 OFF1 OFF1 b1 OFF1 AND
XX12 CLK1 Vref N003 com_sampleandhold params: C=1u, IC=0
XX13 CLK2 COMP1 N004 com_sampleandhold params: C=1u, IC=1
A13 N005 OFF2 N006 OFF2 OFF2 OFF2 b2 OFF2 AND
XX17 CLK2 Vref N005 com_sampleandhold params: C=1u, IC=0
XX18 CLK3 COMP2 N006 com_sampleandhold params: C=1u, IC=1
A15 N007 OFF3 N008 OFF3 OFF3 OFF3 b3 OFF3 AND
XX19 CLK3 Vref N007 com_sampleandhold params: C=1u, IC=0
XX20 CLK4 COMP3 N008 com_sampleandhold params: C=1u, IC=1
A17 N009 OFF4 N010 OFF4 OFF4 OFF4 b4 OFF4 AND
XX21 CLK4 Vref N009 com_sampleandhold params: C=1u, IC=0
XX22 CLK5 COMP4 N010 com_sampleandhold params: C=1u, IC=1
A23 N011 OFF5 N012 OFF5 OFF5 OFF5 b5 OFF5 AND
XX23 CLK5 Vref N011 com_sampleandhold params: C=1u, IC=0
XX24 CLK6 COMP5 N012 com_sampleandhold params: C=1u, IC=1
A25 N013 OFF6 N014 OFF6 OFF6 OFF6 b6 OFF6 AND
XX25 CLK6 Vref N013 com_sampleandhold params: C=1u, IC=0
XX26 CLK7 COMP6 N014 com_sampleandhold params: C=1u, IC=1
A27 N015 OFF7 Vref OFF7 OFF7 OFF7 b7 OFF7 AND
XX27 CLK7 Vref N015 com_sampleandhold params: C=1u, IC=0
V16 OFF0 0 {0*SAR_Voffset}
V17 OFF1 0 {1*SAR_Voffset}
V18 OFF2 0 {2*SAR_Voffset}
V19 OFF3 0 {3*SAR_Voffset}
V20 OFF4 0 {4*SAR_Voffset}
V21 OFF5 0 {5*SAR_Voffset}
V22 OFF6 0 {6*SAR_Voffset}
V23 OFF7 0 {7*SAR_Voffset}
V1 COMP_ 0 PULSE(0 1.01 {t_delay} 1n 1n {2*t_on} {4*t_on} 4)
V11 P 0 PWL(1m 1 +1m 0 +1m 1 +1m 0)
;TIMINGS
.param t_delay {T_CONV_BEGIN}
.param t_conv_period {T_CONV_PERIOD}
.param Nbits 8
.param t_on {t_conv_period/(Nbits*1.1)}
.param t_period 10m
; HOLD Capacitor Capacitance
.param c_hold 1u
; OFFSET Voltage on the SAR Output
.param SAR_Voffset 0.02
* MSB
* LSB
;Reference Parameters and Model Definitions
.param vref 1
.ic V(c0_ic)=0
.model SW SW(Ron=0.01 Roff=10g Vt=0.5 Vh=0)
.lib opamp.sub
.tran 1m 10m
* Comparator Sampling Clocks
.param t1 {t_on+t_delay}
.param t1_delay {t1+0.01*t_on}
.param t2 {2*t_on+t_delay}
;TIMINGS
.param t_conv 2m  ; {t_conversion}
.ends com_sar

.subckt com_sampleandhold SAM VIN OUT
XU1 OUT c0_ic OUT opamp Aol=1000K GBW=10000Meg  ; pins invin noninvin out
S1 VIN c0_ic SAM 0 SW
C1 c0_ic 0 {C}
.ic V(c0_ic)={IC}
.lib opamp.sub
.model SW SW(Ron=1 Roff=10g Vt=0.5 Vh=0)
.tran 1m 10m
.ends com_sampleandhold

.subckt com_comparator + - OUT
B§1 OUT 0 V={if(V(+)>V(-),1,0)}
.ends com_comparator

;ANALYSIS commands
.tran {1m} {10m}
;MODEL Definitions
.model SW SW(Ron=5 Roff=10g Vt=0.5 Vh=0)
;TIMING
.param t_period 3m
.param t_on 0.5m
.param t_offset 0.1m
.param t_delay 1m
.param t_conv_begin {t_delay+t_on+t_offset*1.05}
.param t_conv_period {t_period+t_offset-t_on}
;BASE capacitance values
.param c_lsb 10n
* TIMING
* SPICE DIRECTIVES
.backanno
.end